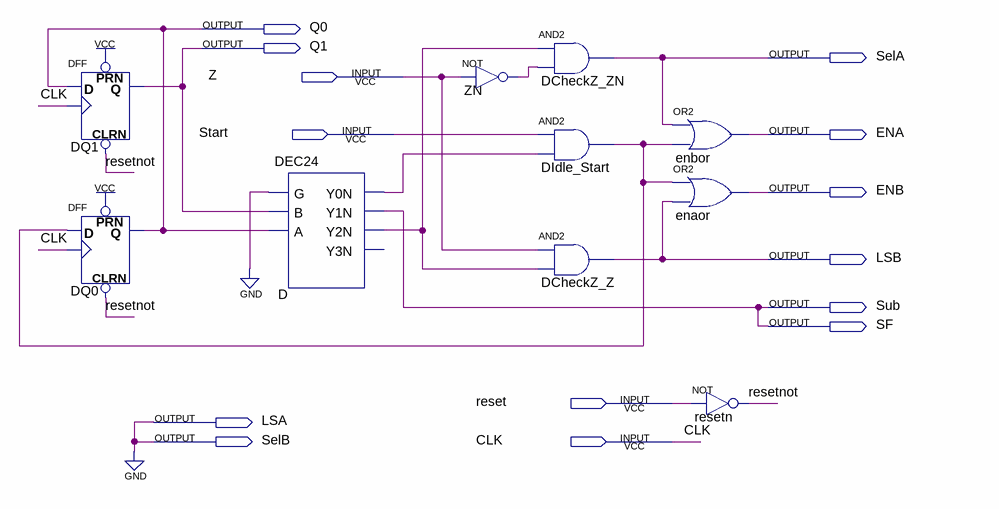
[diagram p0: schematic sheet]
// Quartus schematic ControlUnit.bdf as structural Verilog: 10 symbols, 14 pins
module ControlUnit (
  input  Z,
  input  Start,
  input  reset,
  input  CLK,
  output Q0,
  output Q1,
  output SelA,
  output ENA,
  output ENB,
  output LSB,
  output Sub,
  output SF,
  output LSA,
  output SelB
);

  wire D_y0n, D_y2n, DIdle_Start_out, resetnot, ZN_out;

  DFF DQ1 (.CLRN(resetnot), .CLK(CLK), .D(Q0), .PRN(1'b1), .Q(Q1));
  DFF DQ0 (.CLRN(resetnot), .CLK(CLK), .D(DIdle_Start_out), .PRN(1'b1), .Q(Q0));
  DEC24 D (.G(1'b0), .A(Q0), .B(Q1), .Y0N(D_y0n), .Y1N(SF), .Y2N(D_y2n));  // open: Y3N
  not ZN (ZN_out, Z);
  and DCheckZ_ZN (SelA, D_y2n, ZN_out);
  and DIdle_Start (DIdle_Start_out, Start, D_y0n);
  and DCheckZ_Z (LSB, Z, D_y2n);
  or enbor (ENA, SelA, DIdle_Start_out);
  or enaor (ENB, DIdle_Start_out, LSB);
  not resetn (resetnot, reset);

  assign LSA = 1'b0;
  assign SelB = 1'b0;
  assign Sub = SF;
endmodule
